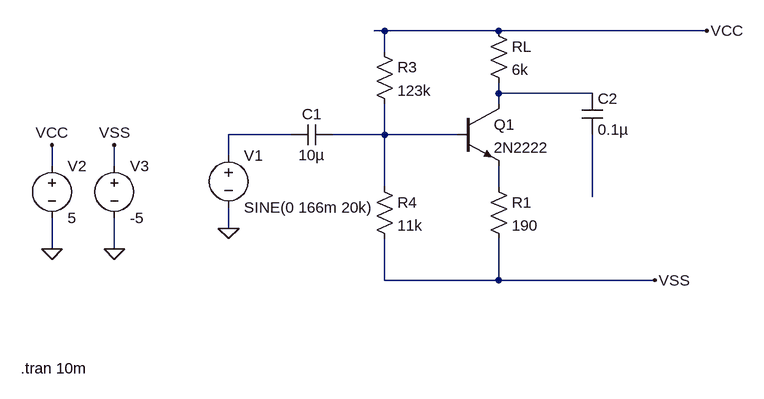
[diagram p0: schematic Gain stage.asc]
Gain stage.asc, the LTspice schematic file:
Version 4.1
SHEET 1 880 680
WIRE 96 48 80 48
WIRE 272 48 96 48
WIRE 592 48 272 48
WIRE 96 80 96 48
WIRE 272 144 272 128
WIRE 416 144 272 144
WIRE 272 160 272 144
WIRE -48 208 -144 208
WIRE 96 208 96 160
WIRE 96 208 16 208
WIRE 208 208 96 208
WIRE -144 240 -144 208
WIRE -416 256 -416 224
WIRE -320 256 -320 224
WIRE 96 288 96 208
WIRE 272 288 272 256
WIRE 416 304 416 208
WIRE -144 352 -144 320
WIRE -416 384 -416 336
WIRE -320 384 -320 336
WIRE 96 432 96 368
WIRE 272 432 272 368
WIRE 272 432 96 432
WIRE 512 432 272 432
FLAG -144 352 0
FLAG -416 384 0
FLAG -320 384 0
FLAG -416 224 VCC
FLAG -320 224 VSS
FLAG 592 48 VCC
FLAG 512 432 VSS
SYMBOL npn 208 160 R0
SYMATTR InstName Q1
SYMATTR Value 2N2222
SYMBOL res 256 272 R0
SYMATTR InstName R1
SYMATTR Value 190
SYMBOL res 256 32 R0
SYMATTR InstName RL
SYMATTR Value 6k
SYMBOL res 80 64 R0
SYMATTR InstName R3
SYMATTR Value 123k
SYMBOL res 80 272 R0
SYMATTR InstName R4
SYMATTR Value 11k
SYMBOL voltage -144 224 R0
WINDOW 123 0 0 Left 0
WINDOW 39 0 0 Left 0
SYMATTR InstName V1
SYMATTR Value SINE(0 166m 20k)
SYMBOL cap 16 192 R90
WINDOW 0 0 32 VBottom 2
WINDOW 3 32 32 VTop 2
SYMATTR InstName C1
SYMATTR Value 10µ
SYMBOL voltage -416 240 R0
WINDOW 123 0 0 Left 0
WINDOW 39 0 0 Left 0
SYMATTR InstName V2
SYMATTR Value 5
SYMBOL voltage -320 240 R0
WINDOW 123 0 0 Left 0
WINDOW 39 0 0 Left 0
SYMATTR InstName V3
SYMATTR Value -5
SYMBOL cap 400 144 R0
SYMATTR InstName C2
SYMATTR Value 0.1µ
TEXT -464 568 Left 2 !.tran 10m

The netlist it stands for:
* Gain stage.asc
Q1 N001 N003 N004 0 2N2222
R1 N004 VSS 190
RL VCC N001 6k
R3 VCC N003 123k
R4 N003 VSS 11k
V1 N002 0 SINE(0 166m 20k)
C1 N003 N002 10µ
V2 VCC 0 5
V3 VSS 0 -5
C2 N001 N005 0.1µ
.model NPN NPN
.model PNP PNP
.lib standard.bjt
.tran 10m
.backanno
.end